# EAGLE schematic Shruti-Main-v01 (EAGLE 5.06)
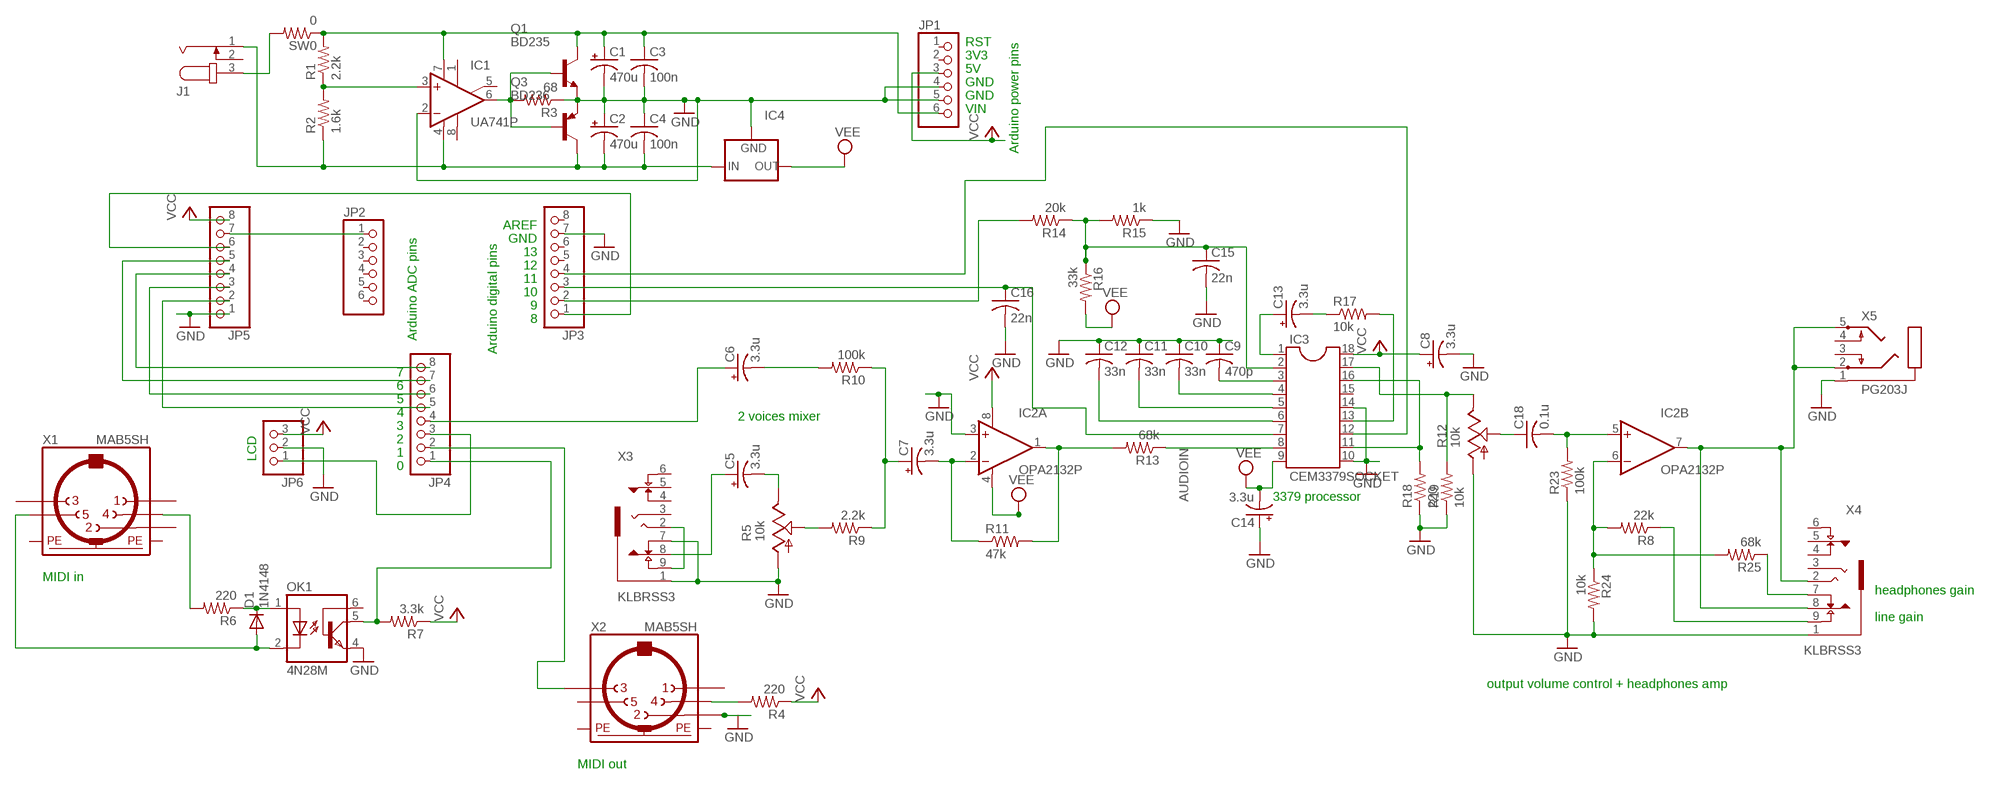
[diagram p0: schematic, sheet 1]

## Parts
C1  470u  CPOL-USE5-10.5  [E5-10,5]
C2  470u  CPOL-USE5-10.5  [E5-10,5]
C3  100n  C-US050-024X044  [C050-024X044]
C4  100n  C-US050-024X044  [C050-024X044]
C5  3.3u  CPOL-USE2.5-6  [E2,5-6]
C6  3.3u  CPOL-USE2.5-6  [E2,5-6]
C7  3.3u  CPOL-USE2.5-6  [E2,5-6]
C8  3.3u  CPOL-USE2.5-6  [E2,5-6]
C9  470p  C-US050-024X044  [C050-024X044]
C10  33n  C-US050-025X075  [C050-025X075]
C11  33n  C-US050-025X075  [C050-025X075]
C12  33n  C-US050-025X075  [C050-025X075]
C13  3.3u  CPOL-USE2.5-6  [E2,5-6]
C14  3.3u  CPOL-USE2.5-6  [E2,5-6]
C15  22n  C-US050-025X075  [C050-025X075]
C16  22n  C-US050-025X075  [C050-025X075]
C18  0.1u  C-US050-024X044  [C050-024X044]
D1  1N4148  1N4148DO35-7  [DO35-7]
IC1  UA741P  [DIL08]
IC2  OPA2132P  [DIL08]
IC3  CEM3379SOCKET  [SOCKET18]
IC4  79XXL  [79XXL]
J1  JACK-PLUG1  [SPC4078]
JP1  PINHD-1X6  [1X06]
JP2  PINHD-1X6  [1X06]
JP3  PINHD-1X8  [1X08]
JP4  PINHD-1X8  [1X08]
JP5  PINHD-1X8  [1X08]
JP6  PINHD-1X3  [1X03]
OK1  4N28M  [DIL06]
Q1  BD235  [TO126]
Q3  BD236  [TO126]
R1  2.2k  R-US_0207/10  [0207/10]
R2  1.6k  R-US_0207/10  [0207/10]
R3  68  R-US_0207/10  [0207/10]
R4  220  R-US_0204/7  [0204/7]
R5  10k  POT_USCABLED  [CABLE_POT_6MM]
R6  220  R-US_0204/7  [0204/7]
R7  3.3k  R-US_0204/7  [0204/7]
R8  22k  R-US_0204/7  [0204/7]
R9  2.2k  R-US_0204/7  [0204/7]
R10  100k  R-US_0204/7  [0204/7]
R11  47k  R-US_0207/10  [0207/10]
R12  10k  POT_USCABLED  [CABLE_POT_6MM]
R13  68k  R-US_0207/10  [0207/10]
R14  20k  R-US_0204/7  [0204/7]
R15  1k  R-US_0204/7  [0204/7]
R16  33k  R-US_0204/7  [0204/7]
R17  10k  R-US_0204/7  [0204/7]
R18  220  R-US_0204/7  [0204/7]
R19  10k  R-US_0204/7  [0204/7]
R23  100k  R-US_0204/7  [0204/7]
R24  10k  R-US_0204/7  [0204/7]
R25  68k  R-US_0204/7  [0204/7]
SW0  0  R-US_0204/2V  [0204V]
X1  MAB5SH  [MAB5SH]
X2  MAB5SH  [MAB5SH]
X3  KLBRSS3  [KLBRSS3]
X4  KLBRSS3  [KLBRSS3]
X5  PG203J  [PG203J]

## Nets
AUDIOIN: IC2.1(A:OUT) R11.2 R13.2
GND: C1.- C2.+ C3.2 C4.1 C8.- C9.1 C10.1 C11.1 C12.1 C14.+ C15.2 C16.2 IC1.2(-IN) IC2.3(A:+IN) IC3.10(GND) IC3.14(PANCV) IC4.GND JP1.4 JP1.5 JP3.7 JP5.1 JP6.2 OK1.4(EMI) Q1.1(E) Q3.1(E) R3.1 R5.A R12.A R15.1 R18.1 R19.1 R23.1 R24.2 X2.2 X3.1 X3.7 X4.1 X5.1
N$1: IC1.6(OUT) Q1.3(B) Q3.3(B) R3.2
N$2: C1.+ C3.1 IC1.7(V+) JP1.6 Q1.2(C) R1.2 SW0.1
N$3: IC1.3(+IN) R1.1 R2.2
N$4: JP4.5 JP5.2
N$5: IC3.8(VCFIN) R13.1
N$6: R4.2 X2.4
N$7: JP4.6 JP5.3
N$8: JP2.1 JP5.7
N$9: JP4.7 JP5.5
N$10: JP4.8 JP5.4
N$11: JP3.1 JP5.6
N$12: C6.- R10.2
N$13: JP4.2 X2.3
N$14: D1.C OK1.1(A) R6.1
N$16: D1.A OK1.2(C) X1.5
N$17: R6.2 X1.4
N$18: JP4.1 OK1.5(COL) R7.2
N$19: R5.S R9.2
N$20: C6.+ JP4.4
N$21: C7.- IC2.2(A:-IN) R11.1
N$22: JP4.3 JP6.1
N$23: C7.+ R9.1 R10.1
N$24: IC2.7(B:OUT) X4.2 X4.8 X5.2 X5.5
N$25: C18.2 IC2.5(B:+IN) R23.2
N$26: C9.2 IC3.3(CD)
N$27: C10.2 IC3.4(CC)
N$28: C5.- R5.E
N$29: C11.2 IC3.5(CB)
N$30: IC3.17(CHB) R12.E R19.2
N$31: C12.2 IC3.6(CA)
N$32: JP3.2 R14.2
N$33: C16.1 IC3.7(RESONANCECV) JP3.3
N$34: IC3.12(GAINCV) JP3.4
N$35: IC3.13(VCAIN) R17.2
N$36: C13.- R17.1
N$37: R25.1 X4.7
N$38: IC3.11(VCAOUT) IC3.16(PANIN) R18.2
N$39: C13.+ IC3.1(VCFOUT)
N$40: R8.1 X4.9
N$41: C5.+ X3.8
N$42: C2.- C4.2 IC1.4(V-) IC4.IN J1.1 Q3.2(C) R2.1
N$43: C15.1 IC3.2(FREQUENCYCV) R14.1 R15.2 R16.1
N$44: C18.1 R12.S
N$45: IC2.6(B:-IN) R8.2 R24.1 R25.2
N$46: X3.2 X3.9
N$47: J1.3 SW0.2
VCC: C8.+ IC2.8(A:V+) IC3.18(VCC) JP1.3 JP5.8 JP6.3 R4.1 R7.1
VEE: C14.- IC2.4(A:V-) IC3.9(VEE) IC4.OUT R16.2
Unconnected: IC1.1(ON1) IC1.5(ON2) IC1.8(OPT) IC3.15(CHAOUT) J1.2 JP1.1 JP1.2 JP2.2 JP2.3 JP2.4 JP2.5 JP2.6 JP3.5 JP3.6 JP3.8 OK1.6(BAS) X1.1 X1.2 X1.3 X2.1 X2.5 X3.3 X3.4 X3.5 X3.6 X4.3 X4.4 X4.5 X4.6 X5.3 X5.4

## Notes on the sheet
- RST
- 3V3
- 5V
- GND
- GND
- VIN
- Arduino power pins
- AREF
- GND
- 13
- 12
- 11
- 10
- 9
- 8
- Arduino ADC pins
- Arduino digital pins
- 7
- 6
- 5
- 4
- 3 | 2 voices mixer
- 2
- 1
- LCD | 0
- 3379 processor
- MIDI in
- headphones gain
- line gain
- output volume control + headphones amp
- MIDI out

## Power pins joined to a net without a drawn wire
PE: X1.PE X1.PE@(PE) X2.PE X2.PE@(PE)

## Library data of the parts
C1 C2 C5-C8 C13 C14 = rcl:CPOL-US: POLARIZED CAPACITOR, American symbol
C3 C4 C9-C12 C15 C16 C18 = rcl:C-US: CAPACITOR, American symbol
D1 = diode:1N4148: DIODE high speed (Philips)
IC1 = linear:*741: OP AMP
IC2 = burr-brown:OPA2132: High Speed FET-Input Operational Amplifiers< Product Folder:OPA2132
IC3 = cem:CEM3379: Voltage Controlled Signal Processor VCF+VCA+panner
IC4 = v-reg:79XXL: VOLTAGE REGULATOR
J1 = con-jack:JACK-PLUG: DC POWER JACK Power Jack, DC, Right Angle, Through Hole, Rated 5A at 16VDC, PC Terminals Distributor: Farnell (www.Farnell.de) Drawing: 84N1161.pdf / 84N1162.pdf Manufacturer: SPC Technology (www.spctechnology.com) Type: SPC4077 / SPC 4078
JP1 JP2 = pinhead:PINHD-1X6: PIN HEADER
JP3-JP5 = pinhead:PINHD-1X8: PIN HEADER
JP6 = pinhead:PINHD-1X3: PIN HEADER
OK1 = optocoupler:4N*?M: General Purpose 6-Pin Phototransistor Optocouplers Source: http://www.fairchildsemi.com/ds/4N/4N35-M.pdf
Q1 = transistor-npn:BD235*: NPN Transistor
Q3 = transistor-pnp:BD236: PNP Transistor
R1-R4 R6-R11 R13-R19 R23-R25 SW0 = resistor:R-US_: RESISTOR, American symbol
R5 R12 = pot-cable:POT_US
X1 X2 = con-hirschmann:MAB5SH: Female CONNECTOR 5 pins 90 deg. with shield, horizontal (DIN 41524)
X3 X4 = con-lumberg:KLBRSS3: Jack connectors according to JISC 6560, 6.35 mm Klinkeneinbaukupplung nach JISC 6560, 6,35 mm, 3-polig/stereo, abgewinkelte Ausführung, mit 2 Umschaltern, Leiterplatten Rückseitenmontage Source: http://www.lumberg.de/Produkte/PDFs/KLBRSS3.pdf
X5 = con-hirschmann:PG203J: MIC/HEADPHONE JACK KS-S stereo microphone/headphone jack PG203JN (Schukat)